# EAGLE design Feather-M0-RAK811-UFL (EAGLE 9.5.1)
COMPANY: ADAFRUIT INDUSTRIES; DRAWN: KTOWN; REV: B
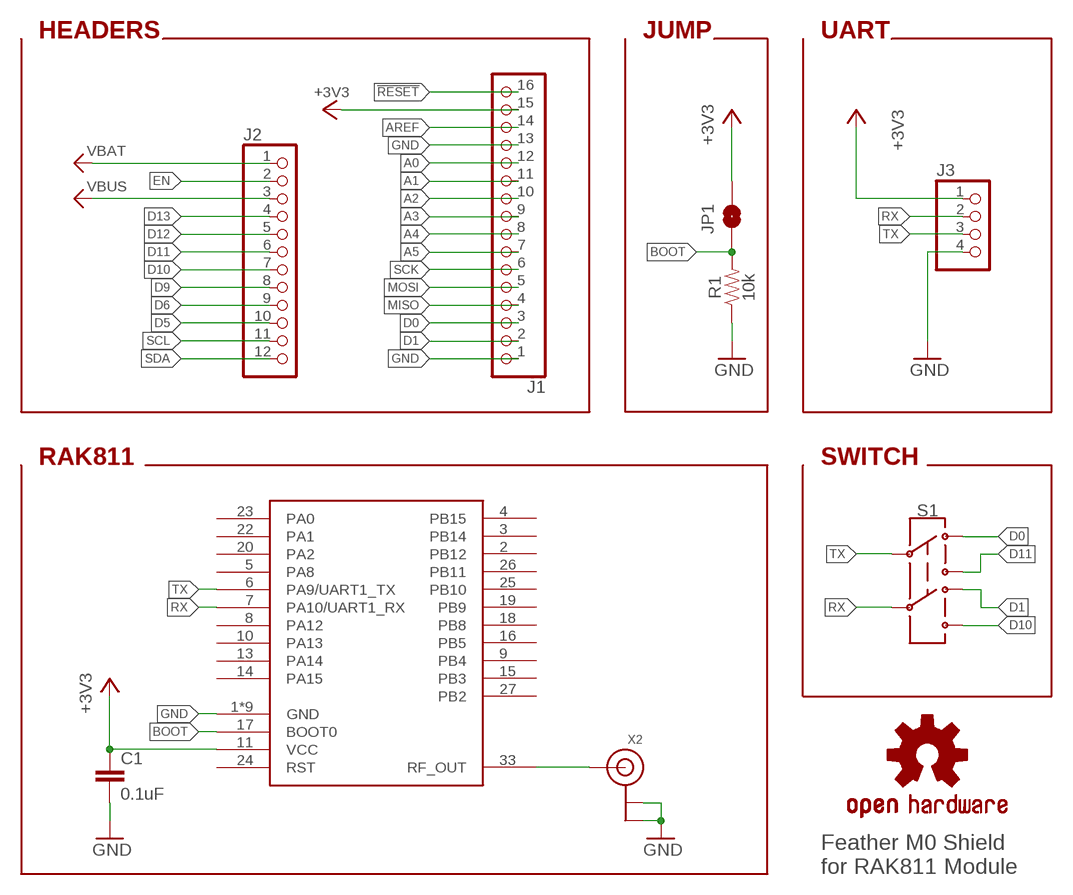
[diagram p0: schematic, sheet 1]

## Parts
C1  0.1uF  0.1UF-0603-25V-(+80/-20%)  [0603]
J1  HEADER-1X16ROUND  [1X16_ROUND]
J2  HEADER-1X12  [1X12_ROUND]
J3  HEADER-1X4ROUND  [1X04_ROUND]
JP1  JUMPER-SMT_2_NO_SILK  [SMT-JUMPER_2_NO_SILK]
LOGO1  OSHW-LOGOS  [OSHW-LOGO-S]
R1  10k  10KOHM-0603-1/10W-1%  [0603]
S1  SWITCH-DPDT-SMD-AYZ0202  [SWITCH_DPDT_SMD_AYZ0202]
U1  RAK_WIRELESS_RAK811  [RAK_WIRELESS_RAK811]
X2  ANTENNA_U.FL  [U.FL]

## Nets
!RESET: J1.16
+3V3: C1.1 J1.15 J3.1 JP1.2 U1.11(VCC)
A0: J1.12
A1: J1.11
A2: J1.10
A3: J1.9
A4: J1.8
A5: J1.7
AREF: J1.14
BOOT: JP1.1 R1.2 U1.17(BOOT0)
D0: J1.3 S1.1
D1: J1.2 S1.4
D5: J2.10
D6: J2.9
D9: J2.8
D10: J2.7 S1.6
D11: J2.6 S1.3
D12: J2.5
D13: J2.4
EN: J2.2
GND: C1.2 J1.1 J1.13 J3.4 R1.1 U1.1(GND) U1.12(GND) U1.21(GND) U1.28(GND) U1.29(GND) U1.30(GND) U1.31(GND) U1.32(GND) U1.34(GND) X2.1(GND) X2.2(GND)
MISO: J1.4
MOSI: J1.5
RF: U1.33(RF_OUT) X2.3(SIGNAL)
RX: J3.2 S1.5 U1.7(PA10/UART1_RX)
SCK: J1.6
SCL: J2.11
SDA: J2.12
TX: J3.3 S1.2 U1.6(PA9/UART1_TX)
VBAT: J2.1
VBUS: J2.3
Unconnected: U1.2(PB12) U1.3(PB14) U1.4(PB15) U1.5(PA8) U1.8(PA12) U1.9(PB4) U1.10(PA13) U1.13(PA14) U1.14(PA15) U1.15(PB3) U1.16(PB5) U1.18(PB8) U1.19(PB9) U1.20(PA2) U1.22(PA1) U1.23(PA0) U1.24(RST) U1.25(PB10) U1.26(PB11) U1.27(PB2)

## Notes on the sheet
- HEADERS | JUMP | UART
- RAK811 | SWITCH
- Feather M0 Shield 
  for RAK811 Module

## Library data of the parts
C1 = SparkFun-Capacitors:0.1UF: 0.1µF ceramic capacitors A capacitor is a passive two-terminal electrical component used to store electrical energy temporarily in an electric field.; PROD_ID: CAP-00810
J1 = microbuilder:HEADER-1X16: PIN HEADER
J2 = microbuilder:HEADER-1X12
J3 = microbuilder:HEADER-1X4: PIN HEADER
JP1 = SparkFun-Jumpers:JUMPER-SMT_2_NO: Normally open jumper This jumper has two pads in close proximity to each other. Apply solder to close the connection. Round pads are easier to solder for beginners, but are a lot larger. SparkFun Product that uses the round pads: SparkFun EL Sequencer <https://www.sparkfun.com/products/12781>
LOGO1 = Particle-Devices:OSHW-LOGO: Open Source Hardware Logo This logo indicates the piece of hardware it is found on incorporates a OSHW license and/or adheres to the definition of open source hardware found here: http://freedomdefined.org/OSHW
R1 = SparkFun-Resistors:10KOHM: 10kΩ resistor A resistor is a passive two-terminal electrical component that implements electrical resistance as a circuit element. Resistors act to reduce current flow, and, at the same time, act to lower voltage levels within circuits. - Wikipedia; PROD_ID: RES-00824
S1 = SparkFun-Switches:SWITCH-DPDT: Double-Pole, Double-Throw (DPDT) Switch Double-pole, double-throw switches. Variant Overview PTH-GPI-152-3013 Used on SparkFun Geiger Counter <https://www.sparkfun.com/products/11345> SMD-AY0202 Surface Mount DPDT Switch <https://www.sparkfun.com/products/597> (COM-00597) Used on e.g. LilyPad Arduino USB - ATmega32U4 Board <https://www.sparkfun.com/products/12049>; PROD_ID: SWCH-08179; SF_SKU: COM-00597
U1 = lora-lorawan-modules:RAK_WIRELESS_RAK811: RAK Wireless LoRaWAN module RAK811 Link: https://www.rakwireless.com/en/module/lora/RAK811
X2 = adafruit:ANTENNA_U.FL: U.FL Antenna Connector

## Board
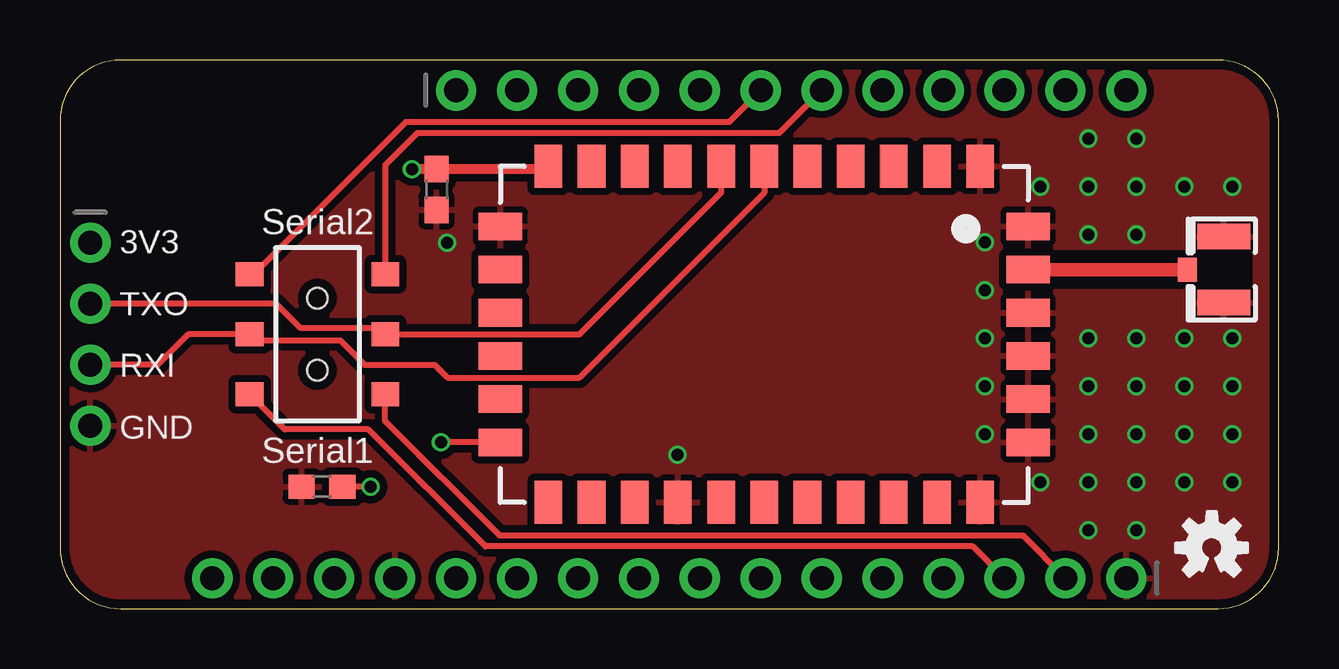
[diagram p1: board, top side]
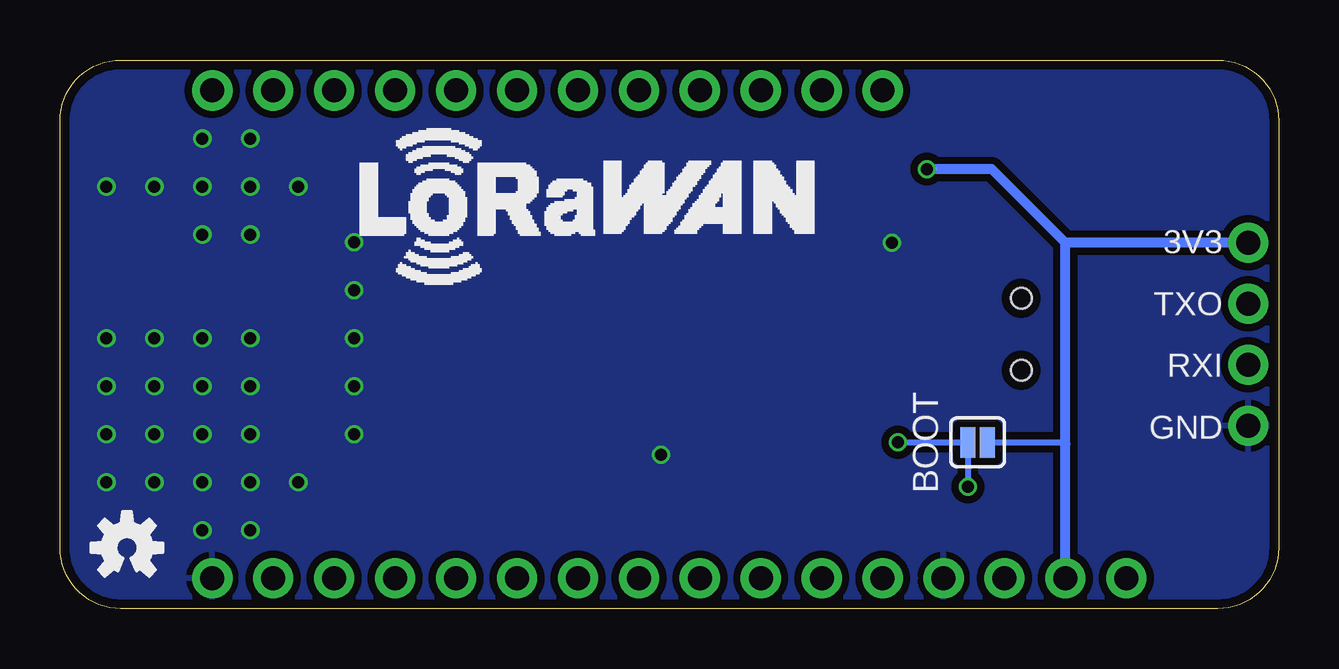
[diagram p2: board, bottom side, seen from below]

Size 50.8 x 22.86 mm. Coordinates in mm from the lower left corner, seen from the top.
Outline: 2.54,0 48.26,0 arc90 50.8,2.54 50.8,20.32 arc90 48.26,22.86 2.54,22.86 arc90 0,20.32 0,2.54 arc90 2.54,0
Copper layers (1*16): Top 0.035559375mm / dielectric 1.6mm / Bottom 0.035559375mm
Design rules "oshpark-2layer *": minimum track width 6mil, minimum drill 10mil, track to track 6mil, track to pad 6mil, pad to pad 6mil, via to via 6mil, smd to smd 6mil, copper to edge 15mil, drill to drill 6mil, minimum pad ring 5mil, minimum via ring 5mil, stop-mask expansion 2.5mil, vias tented up to drill 999mil, thermal gap 10mil
tRestrict: 4 lines
bRestrict: 3 lines

### Footprints (pad centres in the part's own frame; a part is rotated, then mirrored left to right if it is on the bottom)
0603 = smd 1.1 x 1: 1 -0.85,0; 2 0.85,0
1X16_ROUND = drill 1 pad 1.676: 1 -19.05,0; 2 -16.51,0; 3 -13.97,0; 4 -11.43,0; 5 -8.89,0; 6 -6.35,0; 7 -3.81,0; 8 -1.27,0; 9 1.27,0; 10 3.81,0; 11 6.35,0; 12 8.89,0; 13 11.43,0; 14 13.97,0; 15 16.51,0; 16 19.05,0
1X12_ROUND = drill 1 pad 1.676: 1 -13.97,0; 2 -11.43,0; 3 -8.89,0; 4 -6.35,0; 5 -3.81,0; 6 -1.27,0; 7 1.27,0; 8 3.81,0; 9 6.35,0; 10 8.89,0; 11 11.43,0; 12 13.97,0
1X04_ROUND = drill 1 pad 1.676: 1 -3.81,0; 2 -1.27,0; 3 1.27,0; 4 3.81,0
SMT-JUMPER_2_NO_SILK = smd 0.635 x 1.27: 1 -0.406,0; 2 0.406,0
SWITCH_DPDT_SMD_AYZ0202 = smd 1 x 1.15: 1 -2.5,2.825; 2 0,2.825; 3 2.5,2.825; 4 -2.5,-2.825; 5 0,-2.825; 6 2.5,-2.825 | hole 0.85: 1.5,0; -1.5,0
RAK_WIRELESS_RAK811 = smd 1.8 x 1.15: 1 -7,9; 2 -7,7.2; 3 -7,5.4; 4 -7,3.6; 5 -7,1.8; 6 -7,0; 7 -7,-1.8; 8 -7,-3.6; 9 -7,-5.4; 10 -7,-7.2; 11 -7,-9; 18 7,-9; 19 7,-7.2; 20 7,-5.4; 21 7,-3.6; 22 7,-1.8; 23 7,0; 24 7,1.8; 25 7,3.6; 26 7,5.4; 27 7,7.2; 28 7,9 | smd 1.15 x 1.8: 12 -4.5,-11; 13 -2.7,-11; 14 -0.9,-11; 15 0.9,-11; 16 2.7,-11; 17 4.5,-11; 29 4.5,11; 30 2.7,11; 31 0.9,11; 32 -0.9,11; 33 -2.7,11; 34 -4.5,11
U.FL = smd 2.2 x 1.05: 1 0,1.375; 2 0,-1.375 | smd 0.8 x 1: 3 1.525,0

### Placement (x,y rotation side)
C1  15.7,17.47 270 top
J1  25.4,1.27 180 top
J2  30.48,21.59 0 top
J3  1.27,11.43 270 top
JP1  12.55,6.93 0 bottom
LOGO1  48.01,2.54 0 top
LOGO2  OSHW-LOGOS  [OSHW-LOGO-S]  48.01,2.54 0 bottom
R1  10.92,5.08 0 top
S1  10.73,11.43 90 top
U1  29.36,11.43 270 top
U$1  [LORAWAN]  38.35,15.49 0 bottom
X2  48.51,14.13 180 top

### Tracks (layer width: path | path; a pad name or v marks a point on that pad's centre or on a via)
+3V3  (via drill 0.5)
  Top 0.406: v14.67,18.32 C1.1 20.24,18.32 U1.11
  Bottom 0.254: JP1.2 8.89,6.93 8.89,6.86
  Bottom 0.406: J1.15 8.89,6.86 8.89,15.24 | v14.67,18.32 11.97,18.32 9.02,15.37 8.89,15.24 | J3.1 8.89,15.24
BOOT  (via drill 0.5)
  Top 0.254: U1.17 v15.88,6.93 | v12.95,5.08 R1.2
  Bottom 0.254: v12.95,5.08 JP1.1 v15.88,6.93
D0
  Top 0.254: J1.3 38.05,2.59 17.73,2.59 12.85,7.47 9.37,7.47 S1.1
D1
  Top 0.254: J1.2 40.13,3.05 18.31,3.05 13.56,7.8 S1.4
D10
  Top 0.254: J2.7 29.97,19.81 14.89,19.81 13.56,18.48 S1.6
D11
  Top 0.254: J2.6 27.89,20.27 14.41,20.27 8.07,13.93 S1.3
GND  (via drill 0.5)
  other vias: 16.13,15.24 25.74,6.41 46.86,7.27 48.86,7.27 44.86,9.27 42.86,9.27 42.86,15.59 42.86,7.27 44.86,7.27 42.86,5.27 42.86,17.59 48.86,5.27 46.86,5.27 44.86,5.27 44.86,17.59 38.55,7.27 38.55,9.27 38.55,15.27 38.55,11.27 38.55,13.27 42.86,11.27 42.86,19.59 44.86,19.59 42.86,3.27 44.86,3.27 40.86,17.59 40.86,5.27 46.86,17.59 48.86,17.59 44.86,11.27 46.86,11.27 48.86,11.27 48.86,9.27 46.86,9.27 44.86,15.59
  pour Top (isolate 0.305): 0,22.86 0,0 50.8,0 50.8,22.86
  pour Bottom (isolate 0.305): 50.8,0 0,0 0,22.86 50.8,22.86
RF
  Top 0.559: U1.33 X2.3
RX
  Top 0.254: U1.7 27.56,17.33 21.65,11.43 S1.5 13.3,11.68 10.03,11.68 9.02,12.7 J3.2
TX
  Top 0.254: U1.6 29.36,17.33 21.65,9.63 16.15,9.63 15.62,10.16 12.7,10.16 11.68,11.18 8.16,11.18 S1.2 5.33,11.43 4.06,10.16 J3.3

### Text on the board
tPlace: Serial2 | 3V3 / TXO / RXI / GND | Serial1
bPlace: 3V3 / TXO / RXI / GND | BOOT
tDocu: Feather M0 shield for RAK811